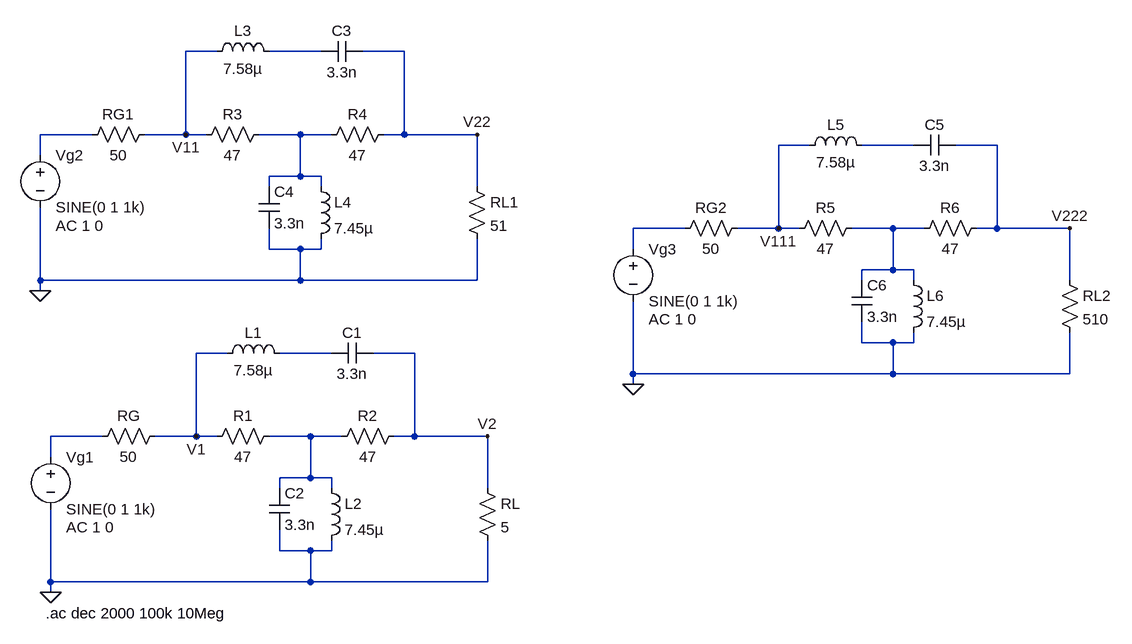
[diagram p0: schematic constant_impedance_laboratory.asc]
constant_impedance_laboratory.asc, the LTspice schematic file:
Version 4
SHEET 1 1732 836
WIRE 352 -480 304 -480
WIRE 512 -480 432 -480
WIRE 640 -480 576 -480
WIRE 160 -352 80 -352
WIRE 304 -352 304 -480
WIRE 304 -352 240 -352
WIRE 336 -352 304 -352
WIRE 480 -352 416 -352
WIRE 528 -352 480 -352
WIRE 640 -352 640 -480
WIRE 640 -352 608 -352
WIRE 752 -352 640 -352
WIRE 1264 -336 1216 -336
WIRE 1424 -336 1344 -336
WIRE 1552 -336 1488 -336
WIRE 80 -320 80 -352
WIRE 480 -288 480 -352
WIRE 480 -288 432 -288
WIRE 512 -288 480 -288
WIRE 432 -272 432 -288
WIRE 512 -272 512 -288
WIRE 752 -272 752 -352
WIRE 1072 -208 992 -208
WIRE 1216 -208 1216 -336
WIRE 1216 -208 1152 -208
WIRE 1248 -208 1216 -208
WIRE 1392 -208 1328 -208
WIRE 1440 -208 1392 -208
WIRE 1552 -208 1552 -336
WIRE 1552 -208 1520 -208
WIRE 1664 -208 1552 -208
WIRE 432 -176 432 -208
WIRE 480 -176 432 -176
WIRE 512 -176 512 -192
WIRE 512 -176 480 -176
WIRE 992 -176 992 -208
WIRE 1392 -144 1392 -208
WIRE 1392 -144 1344 -144
WIRE 1424 -144 1392 -144
WIRE 80 -128 80 -240
WIRE 480 -128 480 -176
WIRE 480 -128 80 -128
WIRE 752 -128 752 -192
WIRE 752 -128 480 -128
WIRE 1344 -128 1344 -144
WIRE 1424 -128 1424 -144
WIRE 1664 -128 1664 -208
WIRE 80 -112 80 -128
WIRE 1344 -32 1344 -64
WIRE 1392 -32 1344 -32
WIRE 1424 -32 1424 -48
WIRE 1424 -32 1392 -32
WIRE 368 -16 320 -16
WIRE 528 -16 448 -16
WIRE 656 -16 592 -16
WIRE 992 16 992 -96
WIRE 1392 16 1392 -32
WIRE 1392 16 992 16
WIRE 1664 16 1664 -48
WIRE 1664 16 1392 16
WIRE 992 32 992 16
WIRE 176 112 96 112
WIRE 320 112 320 -16
WIRE 320 112 256 112
WIRE 352 112 320 112
WIRE 496 112 432 112
WIRE 544 112 496 112
WIRE 656 112 656 -16
WIRE 656 112 624 112
WIRE 768 112 656 112
WIRE 96 144 96 112
WIRE 496 176 496 112
WIRE 496 176 448 176
WIRE 528 176 496 176
WIRE 448 192 448 176
WIRE 528 192 528 176
WIRE 768 192 768 112
WIRE 448 288 448 256
WIRE 496 288 448 288
WIRE 528 288 528 272
WIRE 528 288 496 288
WIRE 96 336 96 224
WIRE 496 336 496 288
WIRE 496 336 96 336
WIRE 768 336 768 272
WIRE 768 336 496 336
WIRE 96 352 96 336
FLAG 96 352 0
FLAG 768 112 V2
FLAG 320 112 V1
FLAG 80 -112 0
FLAG 752 -352 V22
FLAG 304 -352 V11
FLAG 992 32 0
FLAG 1664 -208 V222
FLAG 1216 -208 V111
SYMBOL voltage 96 128 R0
WINDOW 123 24 124 Left 2
WINDOW 39 0 0 Left 0
SYMATTR Value2 AC 1 0
SYMATTR InstName Vg1
SYMATTR Value SINE(0 1 1k)
SYMBOL res 272 96 R90
WINDOW 0 0 56 VBottom 2
WINDOW 3 32 56 VTop 2
SYMATTR InstName RG
SYMATTR Value 50
SYMBOL res 448 96 R90
WINDOW 0 0 56 VBottom 2
WINDOW 3 32 56 VTop 2
SYMATTR InstName R1
SYMATTR Value 47
SYMBOL res 640 96 R90
WINDOW 0 0 56 VBottom 2
WINDOW 3 32 56 VTop 2
SYMATTR InstName R2
SYMATTR Value 47
SYMBOL res 752 176 R0
SYMATTR InstName RL
SYMATTR Value 5
SYMBOL ind 352 0 R270
WINDOW 0 32 56 VTop 2
WINDOW 3 5 56 VBottom 2
SYMATTR InstName L1
SYMATTR Value 7.58µ
SYMBOL cap 528 0 R270
WINDOW 0 32 32 VTop 2
WINDOW 3 0 32 VBottom 2
SYMATTR InstName C1
SYMATTR Value 3.3n
SYMBOL ind 512 176 R0
SYMATTR InstName L2
SYMATTR Value 7.45µ
SYMBOL cap 432 192 R0
SYMATTR InstName C2
SYMATTR Value 3.3n
SYMBOL voltage 80 -336 R0
WINDOW 123 24 124 Left 2
WINDOW 39 0 0 Left 0
SYMATTR Value2 AC 1 0
SYMATTR InstName Vg2
SYMATTR Value SINE(0 1 1k)
SYMBOL res 256 -368 R90
WINDOW 0 0 56 VBottom 2
WINDOW 3 32 56 VTop 2
SYMATTR InstName RG1
SYMATTR Value 50
SYMBOL res 432 -368 R90
WINDOW 0 0 56 VBottom 2
WINDOW 3 32 56 VTop 2
SYMATTR InstName R3
SYMATTR Value 47
SYMBOL res 624 -368 R90
WINDOW 0 0 56 VBottom 2
WINDOW 3 32 56 VTop 2
SYMATTR InstName R4
SYMATTR Value 47
SYMBOL res 736 -288 R0
SYMATTR InstName RL1
SYMATTR Value 51
SYMBOL ind 336 -464 R270
WINDOW 0 32 56 VTop 2
WINDOW 3 5 56 VBottom 2
SYMATTR InstName L3
SYMATTR Value 7.58µ
SYMBOL cap 512 -464 R270
WINDOW 0 32 32 VTop 2
WINDOW 3 0 32 VBottom 2
SYMATTR InstName C3
SYMATTR Value 3.3n
SYMBOL ind 496 -288 R0
SYMATTR InstName L4
SYMATTR Value 7.45µ
SYMBOL cap 416 -272 R0
SYMATTR InstName C4
SYMATTR Value 3.3n
SYMBOL voltage 992 -192 R0
WINDOW 123 24 124 Left 2
WINDOW 39 0 0 Left 0
SYMATTR Value2 AC 1 0
SYMATTR InstName Vg3
SYMATTR Value SINE(0 1 1k)
SYMBOL res 1168 -224 R90
WINDOW 0 0 56 VBottom 2
WINDOW 3 32 56 VTop 2
SYMATTR InstName RG2
SYMATTR Value 50
SYMBOL res 1344 -224 R90
WINDOW 0 0 56 VBottom 2
WINDOW 3 32 56 VTop 2
SYMATTR InstName R5
SYMATTR Value 47
SYMBOL res 1536 -224 R90
WINDOW 0 0 56 VBottom 2
WINDOW 3 32 56 VTop 2
SYMATTR InstName R6
SYMATTR Value 47
SYMBOL res 1648 -144 R0
SYMATTR InstName RL2
SYMATTR Value 510
SYMBOL ind 1248 -320 R270
WINDOW 0 32 56 VTop 2
WINDOW 3 5 56 VBottom 2
SYMATTR InstName L5
SYMATTR Value 7.58µ
SYMBOL cap 1424 -320 R270
WINDOW 0 32 32 VTop 2
WINDOW 3 0 32 VBottom 2
SYMATTR InstName C5
SYMATTR Value 3.3n
SYMBOL ind 1408 -144 R0
SYMATTR InstName L6
SYMATTR Value 7.45µ
SYMBOL cap 1328 -128 R0
SYMATTR InstName C6
SYMATTR Value 3.3n
TEXT 88 384 Left 2 !.ac dec 2000 100k 10Meg

The netlist it stands for:
* constant_impedance_laboratory.asc
Vg1 N008 0 SINE(0 1 1k) AC 1 0
RG V1 N008 50
R1 N009 V1 47
R2 V2 N009 47
RL V2 0 5
L1 V1 N007 7.58µ
C1 N007 V2 3.3n
L2 N009 0 7.45µ
C2 N009 0 3.3n
Vg2 N002 0 SINE(0 1 1k) AC 1 0
RG1 V11 N002 50
R3 N003 V11 47
R4 V22 N003 47
RL1 V22 0 51
L3 V11 N001 7.58µ
C3 N001 V22 3.3n
L4 N003 0 7.45µ
C4 N003 0 3.3n
Vg3 N005 0 SINE(0 1 1k) AC 1 0
RG2 V111 N005 50
R5 N006 V111 47
R6 V222 N006 47
RL2 V222 0 510
L5 V111 N004 7.58µ
C5 N004 V222 3.3n
L6 N006 0 7.45µ
C6 N006 0 3.3n
.ac dec 2000 100k 10Meg
.backanno
.end